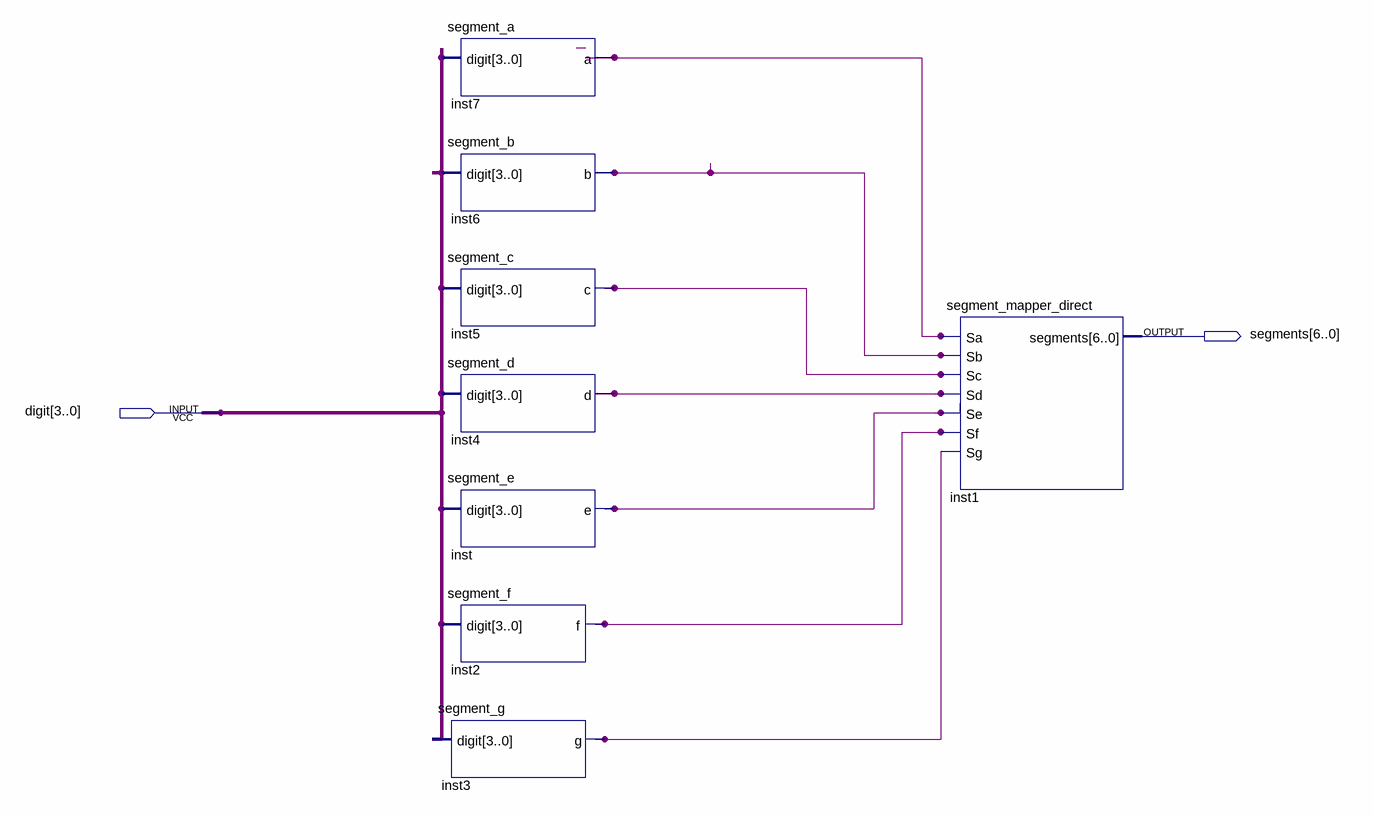
[diagram p0: schematic sheet]
// Quartus schematic sevenSeg.bdf as structural Verilog: 8 symbols, 2 pins
module sevenSeg (
  input  [3:0] digit,
  output [6:0] segments
);

  wire inst2_f, inst3_g, inst4_d, inst5_c, inst6_b, inst7_a, inst_e;

  segment_g inst3 (.digit(digit), .g(inst3_g));
  segment_a inst7 (.digit(digit), .a(inst7_a));
  segment_b inst6 (.digit(digit), .b(inst6_b));
  segment_c inst5 (.digit(digit), .c(inst5_c));
  segment_d inst4 (.digit(digit), .d(inst4_d));
  segment_e inst (.digit(digit), .e(inst_e));
  segment_f inst2 (.digit(digit), .f(inst2_f));
  segment_mapper_direct inst1 (
    .Sa(inst7_a), .Sb(inst6_b), .Sc(inst5_c), .Sd(inst4_d), .Se(inst_e), .Sf(inst2_f), .Sg(inst3_g),
    .segments(segments));
endmodule
